# EAGLE schematic DAQ and eCVT (EAGLE 9.5.2)

## Sheet 1 of 4
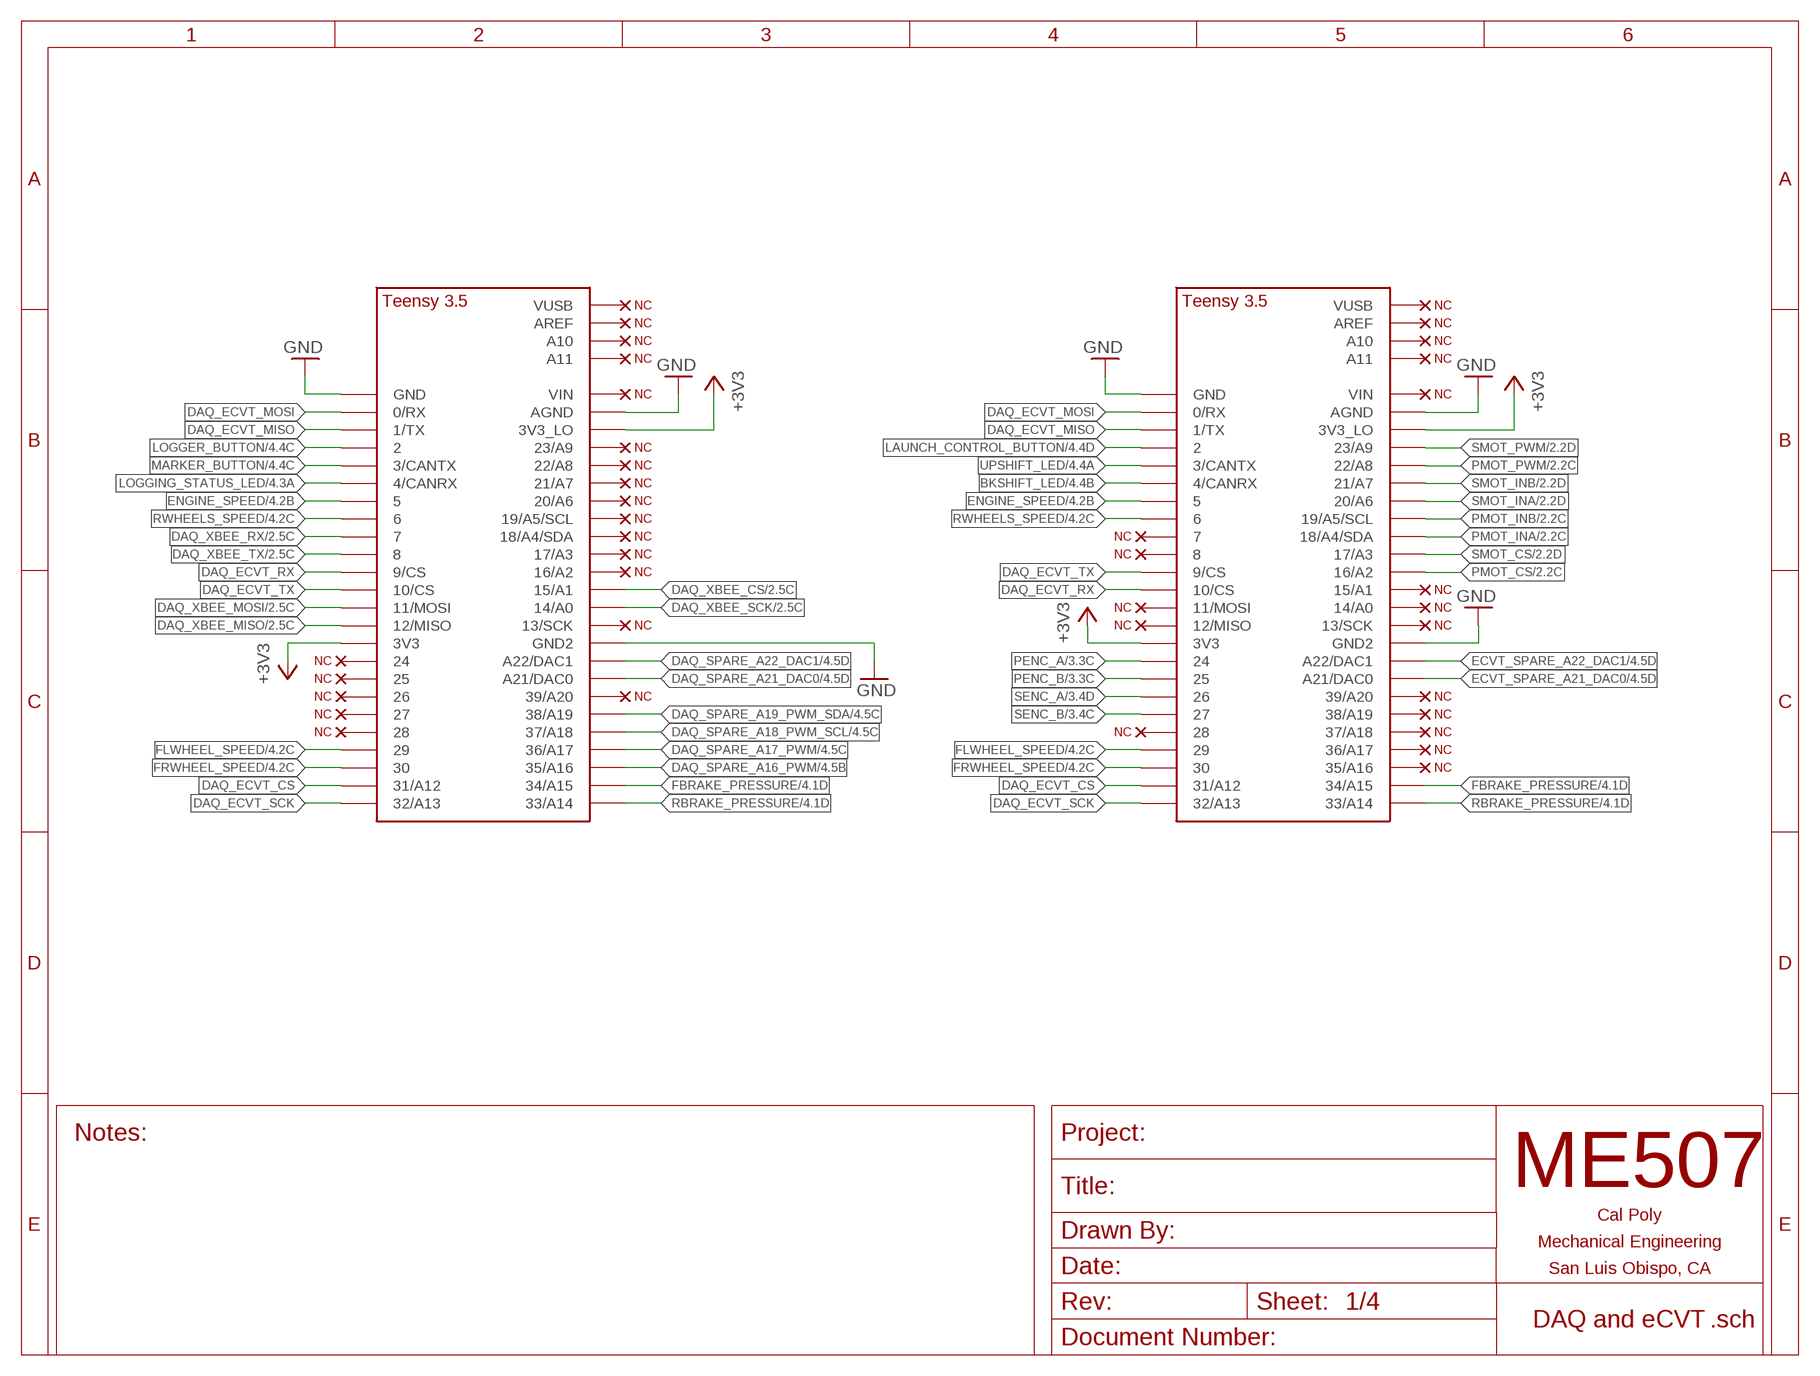
[diagram p0: schematic, sheet 1]

### Parts
DAQ  TEENSY_3.5  [TEENSY_3.5]
ECVT  TEENSY_3.5  [TEENSY_3.5]
U$3  NC  (no package)
U$4  NC  (no package)
U$5  NC  (no package)
U$6  NC  (no package)
U$7  NC  (no package)
U$8  NC  (no package)
U$9  NC  (no package)
U$10  NC  (no package)
U$11  NC  (no package)
U$12  NC  (no package)
U$13  NC  (no package)
U$14  NC  (no package)
U$15  NC  (no package)
U$16  NC  (no package)
U$17  NC  (no package)
U$18  NC  (no package)
U$19  NC  (no package)
U$20  NC  (no package)
U$21  NC  (no package)
U$22  NC  (no package)
U$23  NC  (no package)
U$24  NC  (no package)
U$25  NC  (no package)
U$26  NC  (no package)
U$27  NC  (no package)
U$36  NC  (no package)
U$37  NC  (no package)
U$38  NC  (no package)
U$39  NC  (no package)
U$40  NC  (no package)
U$41  NC  (no package)
U$42  NC  (no package)
U$43  NC  (no package)
U$44  NC  (no package)
U$45  NC  (no package)
U$46  NC  (no package)
U$55  NC  (no package)
U$56  NC  (no package)

### Nets
+3V3: DAQ.3V3 DAQ.3V3_LO ECVT.3V3 ECVT.3V3_LO ; also sheet 2,4
BKSHIFT_LED: ECVT.4/CANRX ; also sheet 4
DAQ_ECVT_CS: DAQ.31/A12 ECVT.31/A12
DAQ_ECVT_MISO: DAQ.1/TX ECVT.1/TX
DAQ_ECVT_MOSI: DAQ.0/RX ECVT.0/RX
DAQ_ECVT_RX: DAQ.9/CS ECVT.10/CS
DAQ_ECVT_SCK: DAQ.32/A13 ECVT.32/A13
DAQ_ECVT_TX: DAQ.10/CS ECVT.9/CS
DAQ_SPARE_A16_PWM: DAQ.35/A16 ; also sheet 4
DAQ_SPARE_A17_PWM: DAQ.36/A17 ; also sheet 4
DAQ_SPARE_A18_PWM_SCL: DAQ.37/A18 ; also sheet 4
DAQ_SPARE_A19_PWM_SDA: DAQ.38/A19 ; also sheet 4
DAQ_SPARE_A21_DAC0: DAQ.21/DAC0(A21/DAC0) ; also sheet 4
DAQ_SPARE_A22_DAC1: DAQ.A22/DAC1 ; also sheet 4
DAQ_XBEE_CS: DAQ.15/A1 ; also sheet 2
DAQ_XBEE_MISO: DAQ.12/MISO ; also sheet 2
DAQ_XBEE_MOSI: DAQ.11/MOSI ; also sheet 2
DAQ_XBEE_RX: DAQ.7 ; also sheet 2
DAQ_XBEE_SCK: DAQ.14/A0 ; also sheet 2
DAQ_XBEE_TX: DAQ.8 ; also sheet 2
ECVT_SPARE_A21_DAC0: ECVT.21/DAC0(A21/DAC0) ; also sheet 4
ECVT_SPARE_A22_DAC1: ECVT.A22/DAC1 ; also sheet 4
ENGINE_SPEED: DAQ.5 ECVT.5 ; also sheet 4
FBRAKE_PRESSURE: DAQ.34/A15 ECVT.34/A15 ; also sheet 4
FLWHEEL_SPEED: DAQ.29 ECVT.29 ; also sheet 4
FRWHEEL_SPEED: DAQ.30 ECVT.30 ; also sheet 4
GND: DAQ.AGND DAQ.GND DAQ.GND2 ECVT.AGND ECVT.GND ECVT.GND2 ; also sheet 2,3,4
LAUNCH_CONTROL_BUTTON: ECVT.2 ; also sheet 4
LOGGER_BUTTON: DAQ.2 ; also sheet 4
LOGGING_STATUS_LED: DAQ.4/CANRX ; also sheet 4
MARKER_BUTTON: DAQ.3/CANTX ; also sheet 4
N$2: DAQ.13/SCK U$4.D
N$3: DAQ.16/A2 U$5.D
N$4: DAQ.17/A3 U$6.D
N$5: DAQ.18/A4/SDA U$7.D
N$6: DAQ.19/A5/SCL U$8.D
N$7: DAQ.20/A6 U$9.D
N$8: DAQ.21/A7 U$10.D
N$9: DAQ.22/A8 U$11.D
N$10: DAQ.23/A9 U$12.D
N$11: DAQ.24 U$13.D
N$12: DAQ.25 U$14.D
N$13: DAQ.26 U$15.D
N$14: DAQ.27 U$16.D
N$15: DAQ.28 U$17.D
N$16: DAQ.VUSB U$18.D
N$17: DAQ.AREF U$19.D
N$18: DAQ.A10 U$20.D
N$19: DAQ.A11 U$21.D
N$20: DAQ.39/A20 U$22.D
N$22: ECVT.13/SCK U$3.D
N$23: ECVT.VUSB U$36.D
N$24: ECVT.28 U$23.D
N$25: ECVT.AREF U$37.D
N$26: ECVT.A10 U$38.D
N$27: ECVT.A11 U$39.D
N$28: ECVT.39/A20 U$40.D
N$29: ECVT.7 U$41.D
N$30: ECVT.8 U$42.D
N$31: ECVT.11/MOSI U$43.D
N$32: ECVT.12/MISO U$44.D
N$33: ECVT.14/A0 U$45.D
N$34: ECVT.15/A1 U$46.D
N$35: ECVT.35/A16 U$24.D
N$36: ECVT.36/A17 U$25.D
N$37: ECVT.37/A18 U$26.D
N$38: ECVT.38/A19 U$27.D
N$54: ECVT.VIN U$55.D
N$55: DAQ.VIN U$56.D
PENC_A: ECVT.24 ; also sheet 3
PENC_B: ECVT.25 ; also sheet 3
PMOT_CS: ECVT.16/A2 ; also sheet 2
PMOT_INA: ECVT.18/A4/SDA ; also sheet 2
PMOT_INB: ECVT.19/A5/SCL ; also sheet 2
PMOT_PWM: ECVT.22/A8 ; also sheet 2
RBRAKE_PRESSURE: DAQ.33/A14 ECVT.33/A14 ; also sheet 4
RWHEELS_SPEED: DAQ.6 ECVT.6 ; also sheet 4
SENC_A: ECVT.26 ; also sheet 3
SENC_B: ECVT.27 ; also sheet 3
SMOT_CS: ECVT.17/A3 ; also sheet 2
SMOT_INA: ECVT.20/A6 ; also sheet 2
SMOT_INB: ECVT.21/A7 ; also sheet 2
SMOT_PWM: ECVT.23/A9 ; also sheet 2
UPSHIFT_LED: ECVT.3/CANTX ; also sheet 4

## Sheet 2 of 4
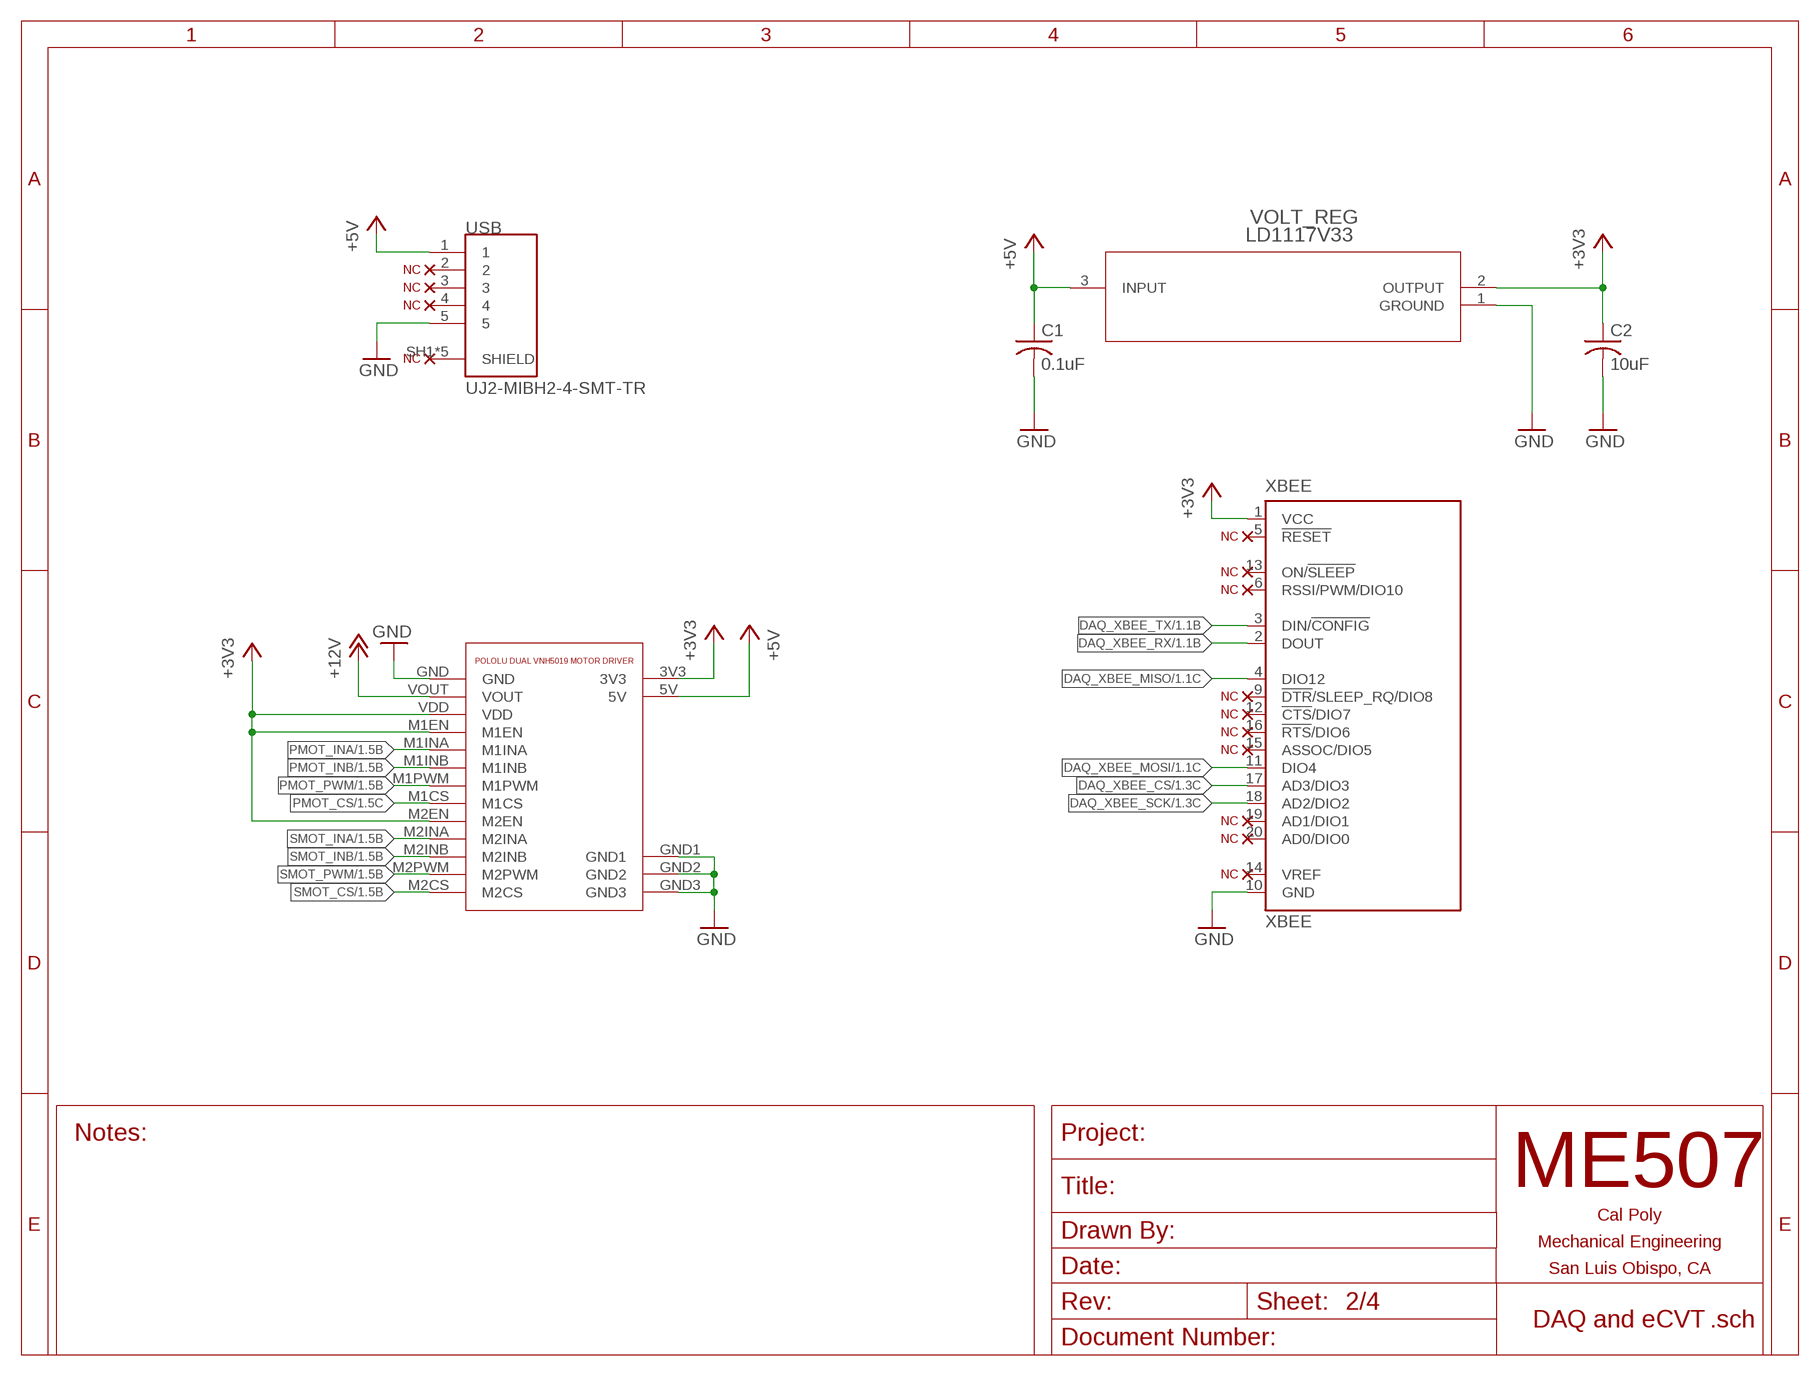
[diagram p1: schematic, sheet 2]

### Parts
C1  0.1uF  C-USC0805  [C0805]
C2  10uF  C-USC0805  [C0805]
MOTOR_DRIVER  POLOLU_DUAL_VNH5019  [POLOLU_DUAL_VNH5019]
U$28  NC  (no package)
U$29  NC  (no package)
U$30  NC  (no package)
U$31  NC  (no package)
U$34  NC  (no package)
U$35  NC  (no package)
U$47  NC  (no package)
U$48  NC  (no package)
U$49  NC  (no package)
U$50  NC  (no package)
U$51  NC  (no package)
U$52  NC  (no package)
U$53  NC  (no package)
U$54  NC  (no package)
USB  UJ2-MIBH2-4-SMT-TR  [CUI_UJ2-MIBH2-4-SMT-TR]
VOLT_REG  LD1117V33  [TO-220]
XBEE  XBEE  [XBEE]

### Nets
+3V3: C2.1 MOTOR_DRIVER.3V3 MOTOR_DRIVER.M1EN MOTOR_DRIVER.M2EN MOTOR_DRIVER.VDD VOLT_REG.2(OUTPUT) XBEE.1(VCC) ; also sheet 1,4
+5V: C1.1 MOTOR_DRIVER.5V USB.1 VOLT_REG.3(INPUT) ; also sheet 3,4
+12V: MOTOR_DRIVER.VOUT ; also sheet 4
DAQ_XBEE_CS: XBEE.17(AD3/DIO3) ; also sheet 1
DAQ_XBEE_MISO: XBEE.4(DIO12) ; also sheet 1
DAQ_XBEE_MOSI: XBEE.11(DIO4) ; also sheet 1
DAQ_XBEE_RX: XBEE.2(DOUT) ; also sheet 1
DAQ_XBEE_SCK: XBEE.18(AD2/DIO2) ; also sheet 1
DAQ_XBEE_TX: XBEE.3(DIN/!CONFIG) ; also sheet 1
GND: C1.2 C2.2 MOTOR_DRIVER.GND MOTOR_DRIVER.GND1 MOTOR_DRIVER.GND2 MOTOR_DRIVER.GND3 USB.5 VOLT_REG.1(GROUND) XBEE.10(GND) ; also sheet 1,3,4
N$1: U$28.D USB.2
N$21: U$29.D USB.3
N$39: U$30.D USB.4
N$40: U$31.D USB.SH1(SHIELD) USB.SH2(SHIELD) USB.SH3(SHIELD) USB.SH4(SHIELD) USB.SH5(SHIELD)
N$43: U$34.D XBEE.5(!RESET)
N$45: U$35.D XBEE.13(ON/!SLEEP)
N$46: U$47.D XBEE.6(RSSI/PWM/DIO10)
N$47: U$48.D XBEE.9(!DTR!/SLEEP_RQ/DIO8)
N$48: U$49.D XBEE.12(!CTS!/DIO7)
N$49: U$50.D XBEE.16(!RTS!/DIO6)
N$50: U$51.D XBEE.15(ASSOC/DIO5)
N$51: U$52.D XBEE.19(AD1/DIO1)
N$52: U$53.D XBEE.20(AD0/DIO0)
N$53: U$54.D XBEE.14(VREF)
PMOT_CS: MOTOR_DRIVER.M1CS ; also sheet 1
PMOT_INA: MOTOR_DRIVER.M1INA ; also sheet 1
PMOT_INB: MOTOR_DRIVER.M1INB ; also sheet 1
PMOT_PWM: MOTOR_DRIVER.M1PWM ; also sheet 1
SMOT_CS: MOTOR_DRIVER.M2CS ; also sheet 1
SMOT_INA: MOTOR_DRIVER.M2INA ; also sheet 1
SMOT_INB: MOTOR_DRIVER.M2INB ; also sheet 1
SMOT_PWM: MOTOR_DRIVER.M2PWM ; also sheet 1

## Sheet 3 of 4
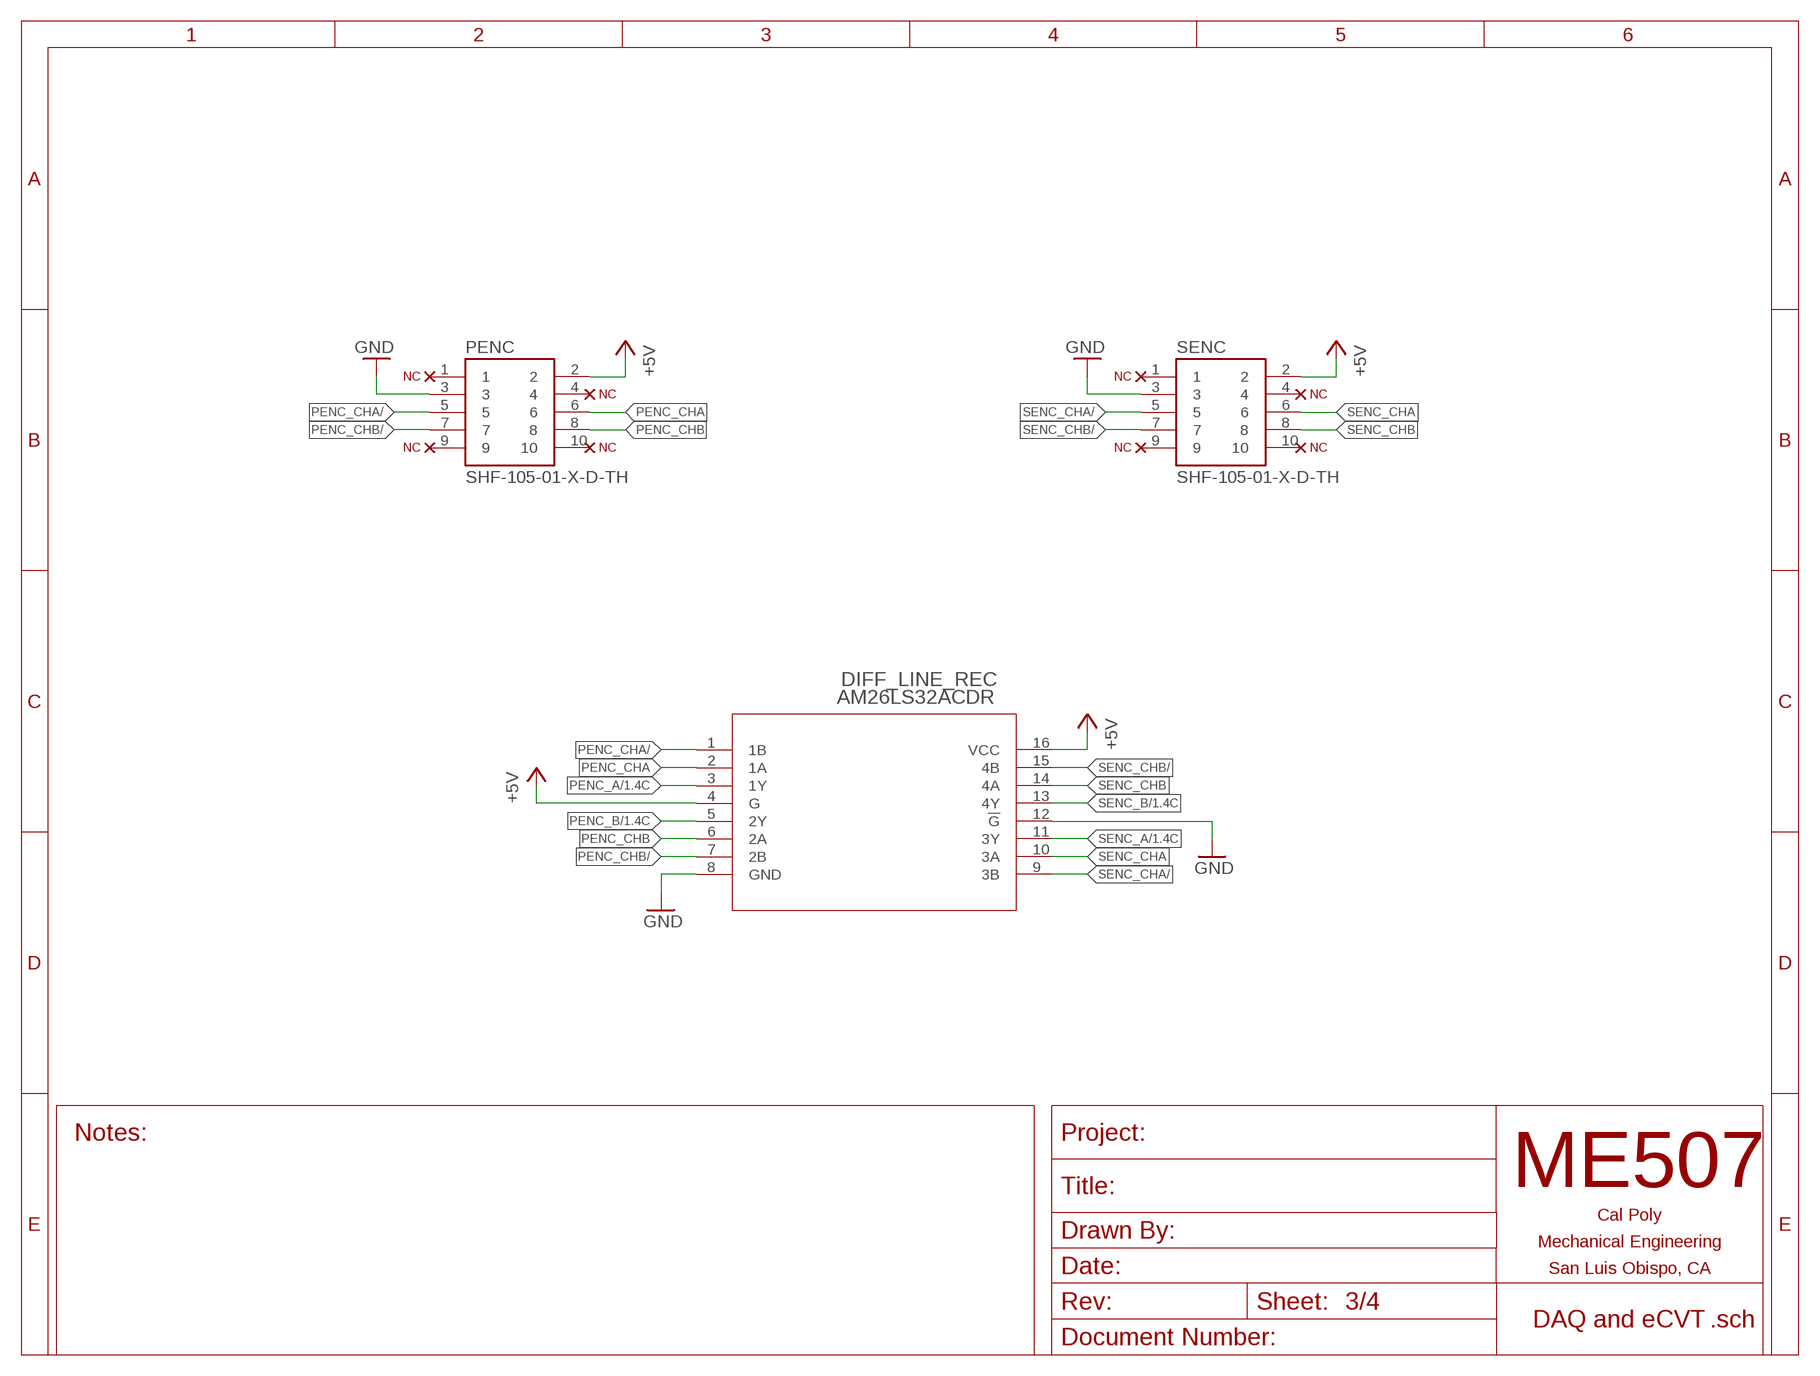
[diagram p2: schematic, sheet 3]

### Parts
DIFF_LINE_REC  AM26LS32ACDR  [D16]
PENC  SHF-105-01-X-D-TH  [SHF-105-01-X-D-TH]
SENC  SHF-105-01-X-D-TH  [SHF-105-01-X-D-TH]
U$59  NC  (no package)
U$60  NC  (no package)
U$61  NC  (no package)
U$62  NC  (no package)
U$63  NC  (no package)
U$64  NC  (no package)
U$65  NC  (no package)
U$66  NC  (no package)

### Nets
+5V: DIFF_LINE_REC.4(G) DIFF_LINE_REC.16(VCC) PENC.2 SENC.2 ; also sheet 2,4
GND: DIFF_LINE_REC.8(GND) DIFF_LINE_REC.12(!G) PENC.3 SENC.3 ; also sheet 1,2,4
N$56: PENC.9 U$61.D
N$59: PENC.10 U$62.D
N$64: PENC.4 U$59.D
N$65: PENC.1 U$60.D
N$68: SENC.4 U$63.D
N$69: SENC.10 U$64.D
N$70: SENC.1 U$65.D
N$71: SENC.9 U$66.D
PENC_A: DIFF_LINE_REC.3(1Y) ; also sheet 1
PENC_B: DIFF_LINE_REC.5(2Y) ; also sheet 1
PENC_CHA: DIFF_LINE_REC.2(1A) PENC.6
PENC_CHA/: DIFF_LINE_REC.1(1B) PENC.5
PENC_CHB: DIFF_LINE_REC.6(2A) PENC.8
PENC_CHB/: DIFF_LINE_REC.7(2B) PENC.7
SENC_A: DIFF_LINE_REC.11(3Y) ; also sheet 1
SENC_B: DIFF_LINE_REC.13(4Y) ; also sheet 1
SENC_CHA: DIFF_LINE_REC.10(3A) SENC.6
SENC_CHA/: DIFF_LINE_REC.9(3B) SENC.5
SENC_CHB: DIFF_LINE_REC.14(4A) SENC.8
SENC_CHB/: DIFF_LINE_REC.15(4B) SENC.7

## Sheet 4 of 4
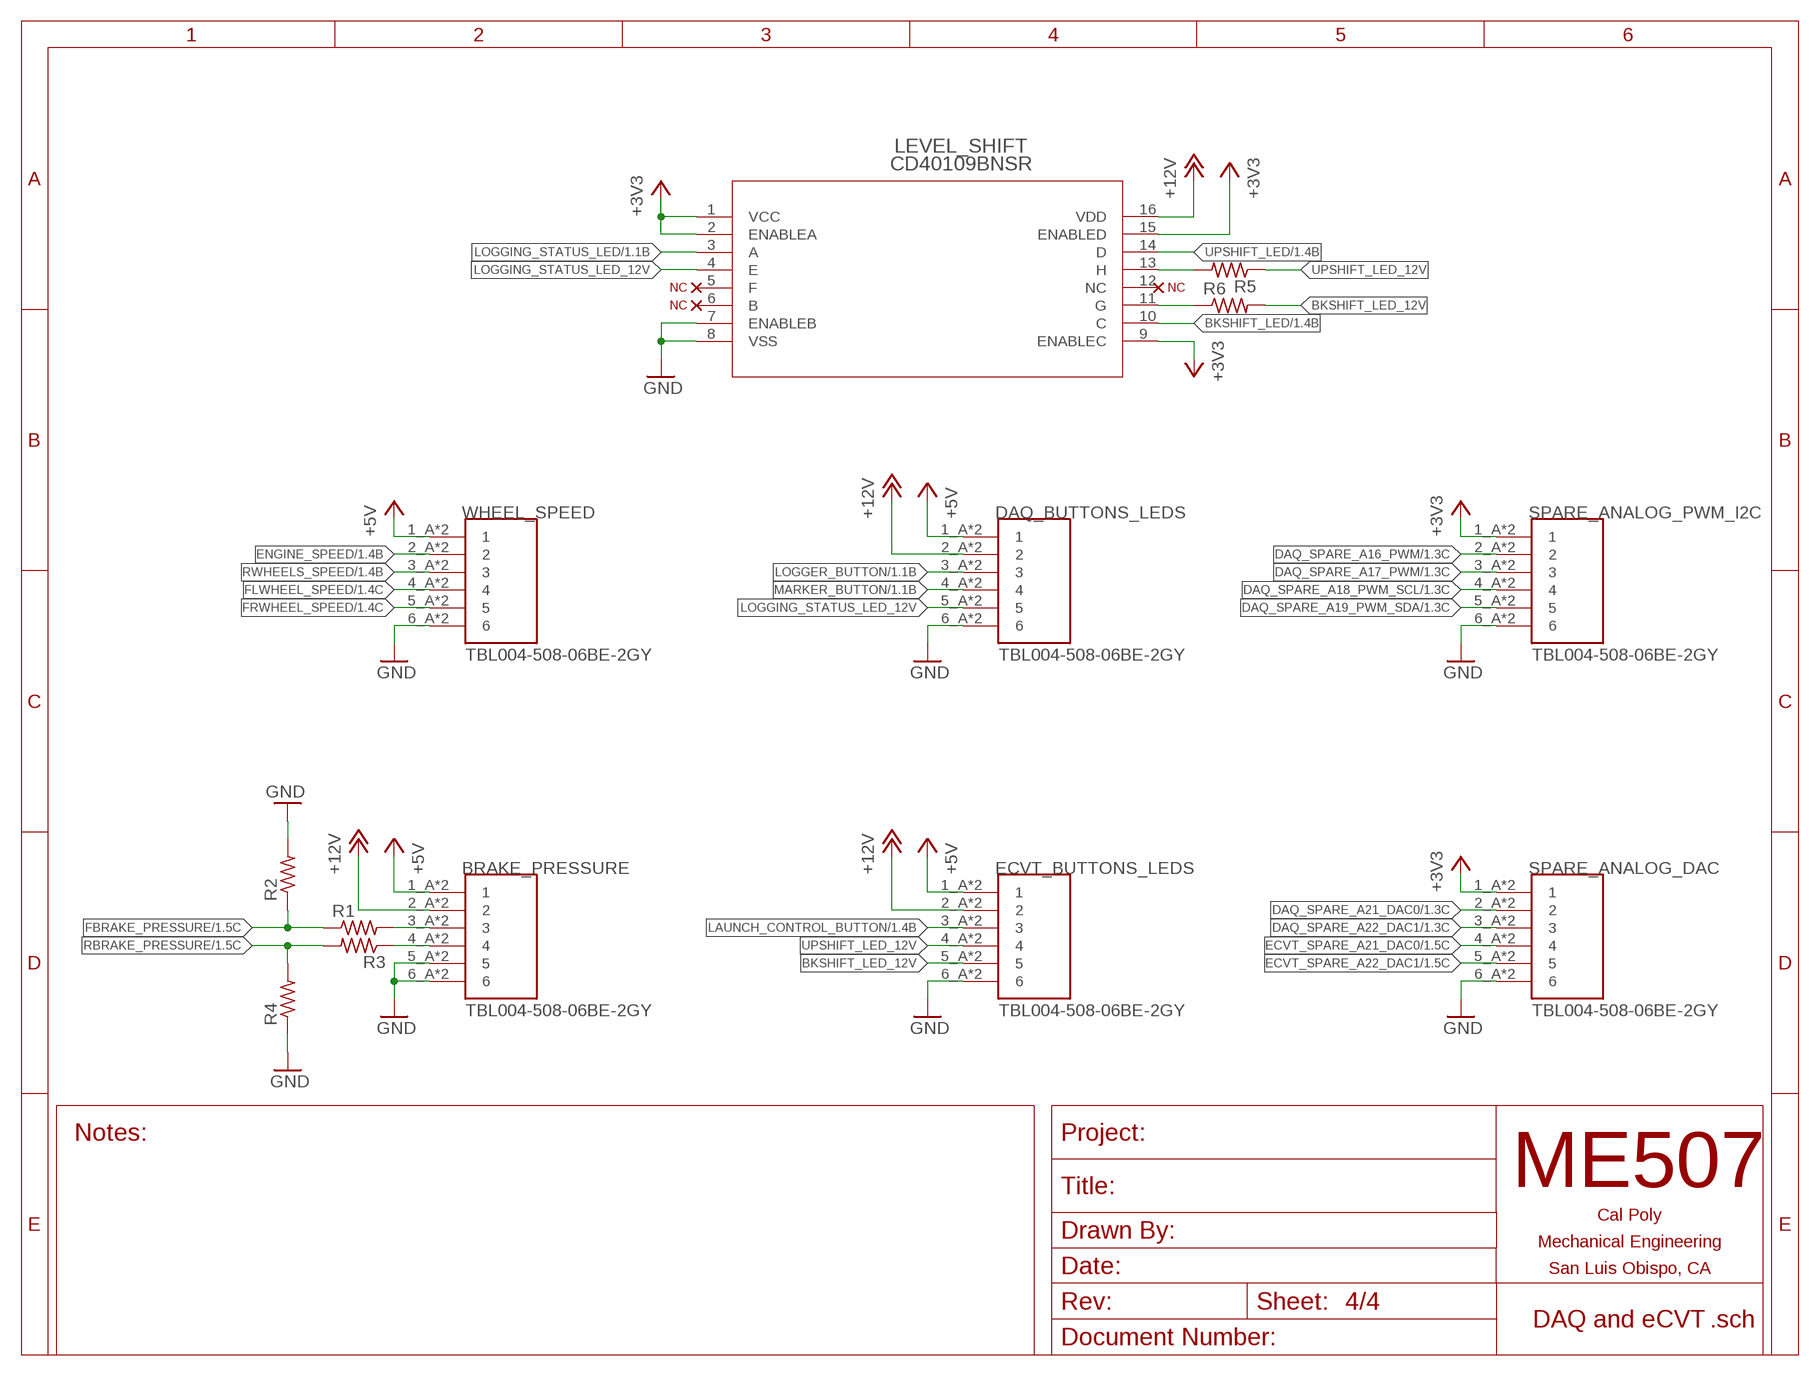
[diagram p3: schematic, sheet 4]

### Parts
BRAKE_PRESSURE  TBL004-508-06BE-2GY  [CUI_TBL004-508-06BE-2GY]
DAQ_BUTTONS_LEDS  TBL004-508-06BE-2GY  [CUI_TBL004-508-06BE-2GY]
ECVT_BUTTONS_LEDS  TBL004-508-06BE-2GY  [CUI_TBL004-508-06BE-2GY]
LEVEL_SHIFT  CD40109BNSR  [NS16]
R1  R-US_0204/7  [0204/7]
R2  R-US_0204/7  [0204/7]
R3  R-US_0204/7  [0204/7]
R4  R-US_0204/7  [0204/7]
R5  R-US_0204/7  [0204/7]
R6  R-US_0204/7  [0204/7]
SPARE_ANALOG_DAC  TBL004-508-06BE-2GY  [CUI_TBL004-508-06BE-2GY]
SPARE_ANALOG_PWM_I2C  TBL004-508-06BE-2GY  [CUI_TBL004-508-06BE-2GY]
U$1  NC  (no package)
U$67  NC  (no package)
U$68  NC  (no package)
WHEEL_SPEED  TBL004-508-06BE-2GY  [CUI_TBL004-508-06BE-2GY]

### Nets
+3V3: LEVEL_SHIFT.1(VCC) LEVEL_SHIFT.2(ENABLEA) LEVEL_SHIFT.9(ENABLEC) LEVEL_SHIFT.15(ENABLED) SPARE_ANALOG_DAC.1_A SPARE_ANALOG_DAC.1_B SPARE_ANALOG_PWM_I2C.1_A SPARE_ANALOG_PWM_I2C.1_B ; also sheet 1,2
+5V: BRAKE_PRESSURE.1_A BRAKE_PRESSURE.1_B DAQ_BUTTONS_LEDS.1_A DAQ_BUTTONS_LEDS.1_B ECVT_BUTTONS_LEDS.1_A ECVT_BUTTONS_LEDS.1_B WHEEL_SPEED.1_A WHEEL_SPEED.1_B ; also sheet 2,3
+12V: BRAKE_PRESSURE.2_A BRAKE_PRESSURE.2_B DAQ_BUTTONS_LEDS.2_A DAQ_BUTTONS_LEDS.2_B ECVT_BUTTONS_LEDS.2_A ECVT_BUTTONS_LEDS.2_B LEVEL_SHIFT.16(VDD) ; also sheet 2
BACKSHIFT_LED_12V_W/O_RES: LEVEL_SHIFT.11(G) R6.1
BKSHIFT_LED: LEVEL_SHIFT.10(C) ; also sheet 1
BKSHIFT_LED_12V: ECVT_BUTTONS_LEDS.5_A ECVT_BUTTONS_LEDS.5_B R6.2
DAQ_SPARE_A16_PWM: SPARE_ANALOG_PWM_I2C.2_A SPARE_ANALOG_PWM_I2C.2_B ; also sheet 1
DAQ_SPARE_A17_PWM: SPARE_ANALOG_PWM_I2C.3_A SPARE_ANALOG_PWM_I2C.3_B ; also sheet 1
DAQ_SPARE_A18_PWM_SCL: SPARE_ANALOG_PWM_I2C.4_A SPARE_ANALOG_PWM_I2C.4_B ; also sheet 1
DAQ_SPARE_A19_PWM_SDA: SPARE_ANALOG_PWM_I2C.5_A SPARE_ANALOG_PWM_I2C.5_B ; also sheet 1
DAQ_SPARE_A21_DAC0: SPARE_ANALOG_DAC.2_A SPARE_ANALOG_DAC.2_B ; also sheet 1
DAQ_SPARE_A22_DAC1: SPARE_ANALOG_DAC.3_A SPARE_ANALOG_DAC.3_B ; also sheet 1
ECVT_SPARE_A21_DAC0: SPARE_ANALOG_DAC.4_A SPARE_ANALOG_DAC.4_B ; also sheet 1
ECVT_SPARE_A22_DAC1: SPARE_ANALOG_DAC.5_A SPARE_ANALOG_DAC.5_B ; also sheet 1
ENGINE_SPEED: WHEEL_SPEED.2_A WHEEL_SPEED.2_B ; also sheet 1
FBRAKE_PRESSURE: R1.1 R2.1 ; also sheet 1
FBRAKE_PRESSURE_W/O_RES: BRAKE_PRESSURE.3_A BRAKE_PRESSURE.3_B R1.2
FLWHEEL_SPEED: WHEEL_SPEED.4_A WHEEL_SPEED.4_B ; also sheet 1
FRWHEEL_SPEED: WHEEL_SPEED.5_A WHEEL_SPEED.5_B ; also sheet 1
GND: BRAKE_PRESSURE.5_A BRAKE_PRESSURE.5_B BRAKE_PRESSURE.6_A BRAKE_PRESSURE.6_B DAQ_BUTTONS_LEDS.6_A DAQ_BUTTONS_LEDS.6_B ECVT_BUTTONS_LEDS.6_A ECVT_BUTTONS_LEDS.6_B LEVEL_SHIFT.7(ENABLEB) LEVEL_SHIFT.8(VSS) R2.2 R4.1 SPARE_ANALOG_DAC.6_A SPARE_ANALOG_DAC.6_B SPARE_ANALOG_PWM_I2C.6_A SPARE_ANALOG_PWM_I2C.6_B WHEEL_SPEED.6_A WHEEL_SPEED.6_B ; also sheet 1,2,3
LAUNCH_CONTROL_BUTTON: ECVT_BUTTONS_LEDS.3_A ECVT_BUTTONS_LEDS.3_B ; also sheet 1
LOGGER_BUTTON: DAQ_BUTTONS_LEDS.3_A DAQ_BUTTONS_LEDS.3_B ; also sheet 1
LOGGING_STATUS_LED: LEVEL_SHIFT.3(A) ; also sheet 1
LOGGING_STATUS_LED_12V: DAQ_BUTTONS_LEDS.5_A DAQ_BUTTONS_LEDS.5_B LEVEL_SHIFT.4(E)
MARKER_BUTTON: DAQ_BUTTONS_LEDS.4_A DAQ_BUTTONS_LEDS.4_B ; also sheet 1
N$41: LEVEL_SHIFT.12(NC) U$1.D
N$58: LEVEL_SHIFT.5(F) U$67.D
N$60: LEVEL_SHIFT.6(B) U$68.D
RBRAKE_PRESSURE: R3.2 R4.2 ; also sheet 1
RBRAKE_PRESSURE_W/O_RES: BRAKE_PRESSURE.4_A BRAKE_PRESSURE.4_B R3.1
RWHEELS_SPEED: WHEEL_SPEED.3_A WHEEL_SPEED.3_B ; also sheet 1
UPSHIFT_LED: LEVEL_SHIFT.14(D) ; also sheet 1
UPSHIFT_LED_12V: ECVT_BUTTONS_LEDS.4_A ECVT_BUTTONS_LEDS.4_B R5.1
UPSHIFT_LED_12V_W/O_RES: LEVEL_SHIFT.13(H) R5.2

## Library data of the parts
BRAKE_PRESSURE DAQ_BUTTONS_LEDS ECVT_BUTTONS_LEDS SPARE_ANALOG_DAC SPARE_ANALOG_PWM_I2C WHEEL_SPEED = Screwless Terminal 6-Pole:TBL004-508-06BE-2GY; MANUFACTURER: CUI; STANDARD: Manufacturer Recommendations
C1 C2 = rcl:C-US: CAPACITOR, American symbol; SPICEPREFIX: C
DAQ ECVT = Teensy:TEENSY_3.5
DIFF_LINE_REC = Quad. Diff. Line Receiver:AM26LS32ACDR; BUILT_BY: EMA_UL_Team; MANUFACTURER: Texas Instruments; MANUFACTURER_PART_NUMBER: AM26LS32ACDR; VENDOR: Texas Instruments
LEVEL_SHIFT = Quad. Level Shifter:CD40109BNSR; BUILT_BY: EMA_UL_Team; MANUFACTURER: Texas Instruments; MANUFACTURER_PART_NUMBER: CD40109BNSR; VENDOR: Texas Instruments
MOTOR_DRIVER = Pololo Dual VNH5019:POLOLU_DUAL_VNH5019
PENC SENC = Male Header 2x5 0.05in:SHF-105-01-X-D-TH: .050 x .050 SHROUDED TERMINAL STRIP.; DESCRIPTION: SHF Series .050 Shrouded Terminal Strip For FFSD; DIGI-KEY_PART_NUMBER: SAM10711-ND; DIGI-KEY_PURCHASE_URL: https://www.digikey.com/product-detail/en/samtec-inc/SHF-105-01-L-D-TH/SAM10711-ND/6561671?utm_source=snapeda&utm_medium=aggregator&utm_campaign=symbol; MF: Samtec; MP: SHF-105-01-L-D-TH; PACKAGE: None
R1-R6 = rcl:R-US_: RESISTOR, American symbol; SPICEPREFIX: R
U$1 U$3-U$31 U$34-U$56 = ME507:NC
U$59-U$68 = ME 507:NC
USB = Micro USB:UJ2-MIBH2-4-SMT-TR: Micro B Type 5 Pin Horizontal 30 µin Plating SMT USB Jack 2.0; CUI_PURCHASE_URL: https://www.cuidevices.com/product/interconnect/connectors/usb-connectors/uj2-mibh2-4-smt?utm_source=snapeda.com&utm_medium=referral&utm_campaign=snapedaBOM; DESCRIPTION: Micro B, USB 2.0, 1.8 A, Right Angle, Surface Mount _SMT_, USB Receptacle; DIGI-KEY_PART_NUMBER: 102-4007-1-ND; DIGI-KEY_PURCHASE_URL: https://www.digikey.com/product-detail/en/cui-devices/UJ2-MIBH2-4-SMT-TR/102-4007-1-ND/6187929?utm_source=snapeda&utm_medium=aggregator&utm_campaign=symbol; MF: CUI Devices; MP: UJ2-MIBH2-4-SMT-TR; PACKAGE: None
VOLT_REG = Voltage Regulator 3.3V:LD1117V33; BUILT_BY: EMA_UL_Team; MANUFACTURER_PART_NUMBER: LD1117V33; VENDOR: STMicroelectronics
XBEE = Xbee:XBEE: XBee (TM) /XBee-PRO(TM) OEM RF Modules Source: MaxStream, Inc. xbee_productmanual.pdf; MPN: XBP24-Z7UIT-004; OC_FARNELL: 1751799; OC_NEWARK: 34R5507